# Altium schematic sheet fpga.SchDoc
size B
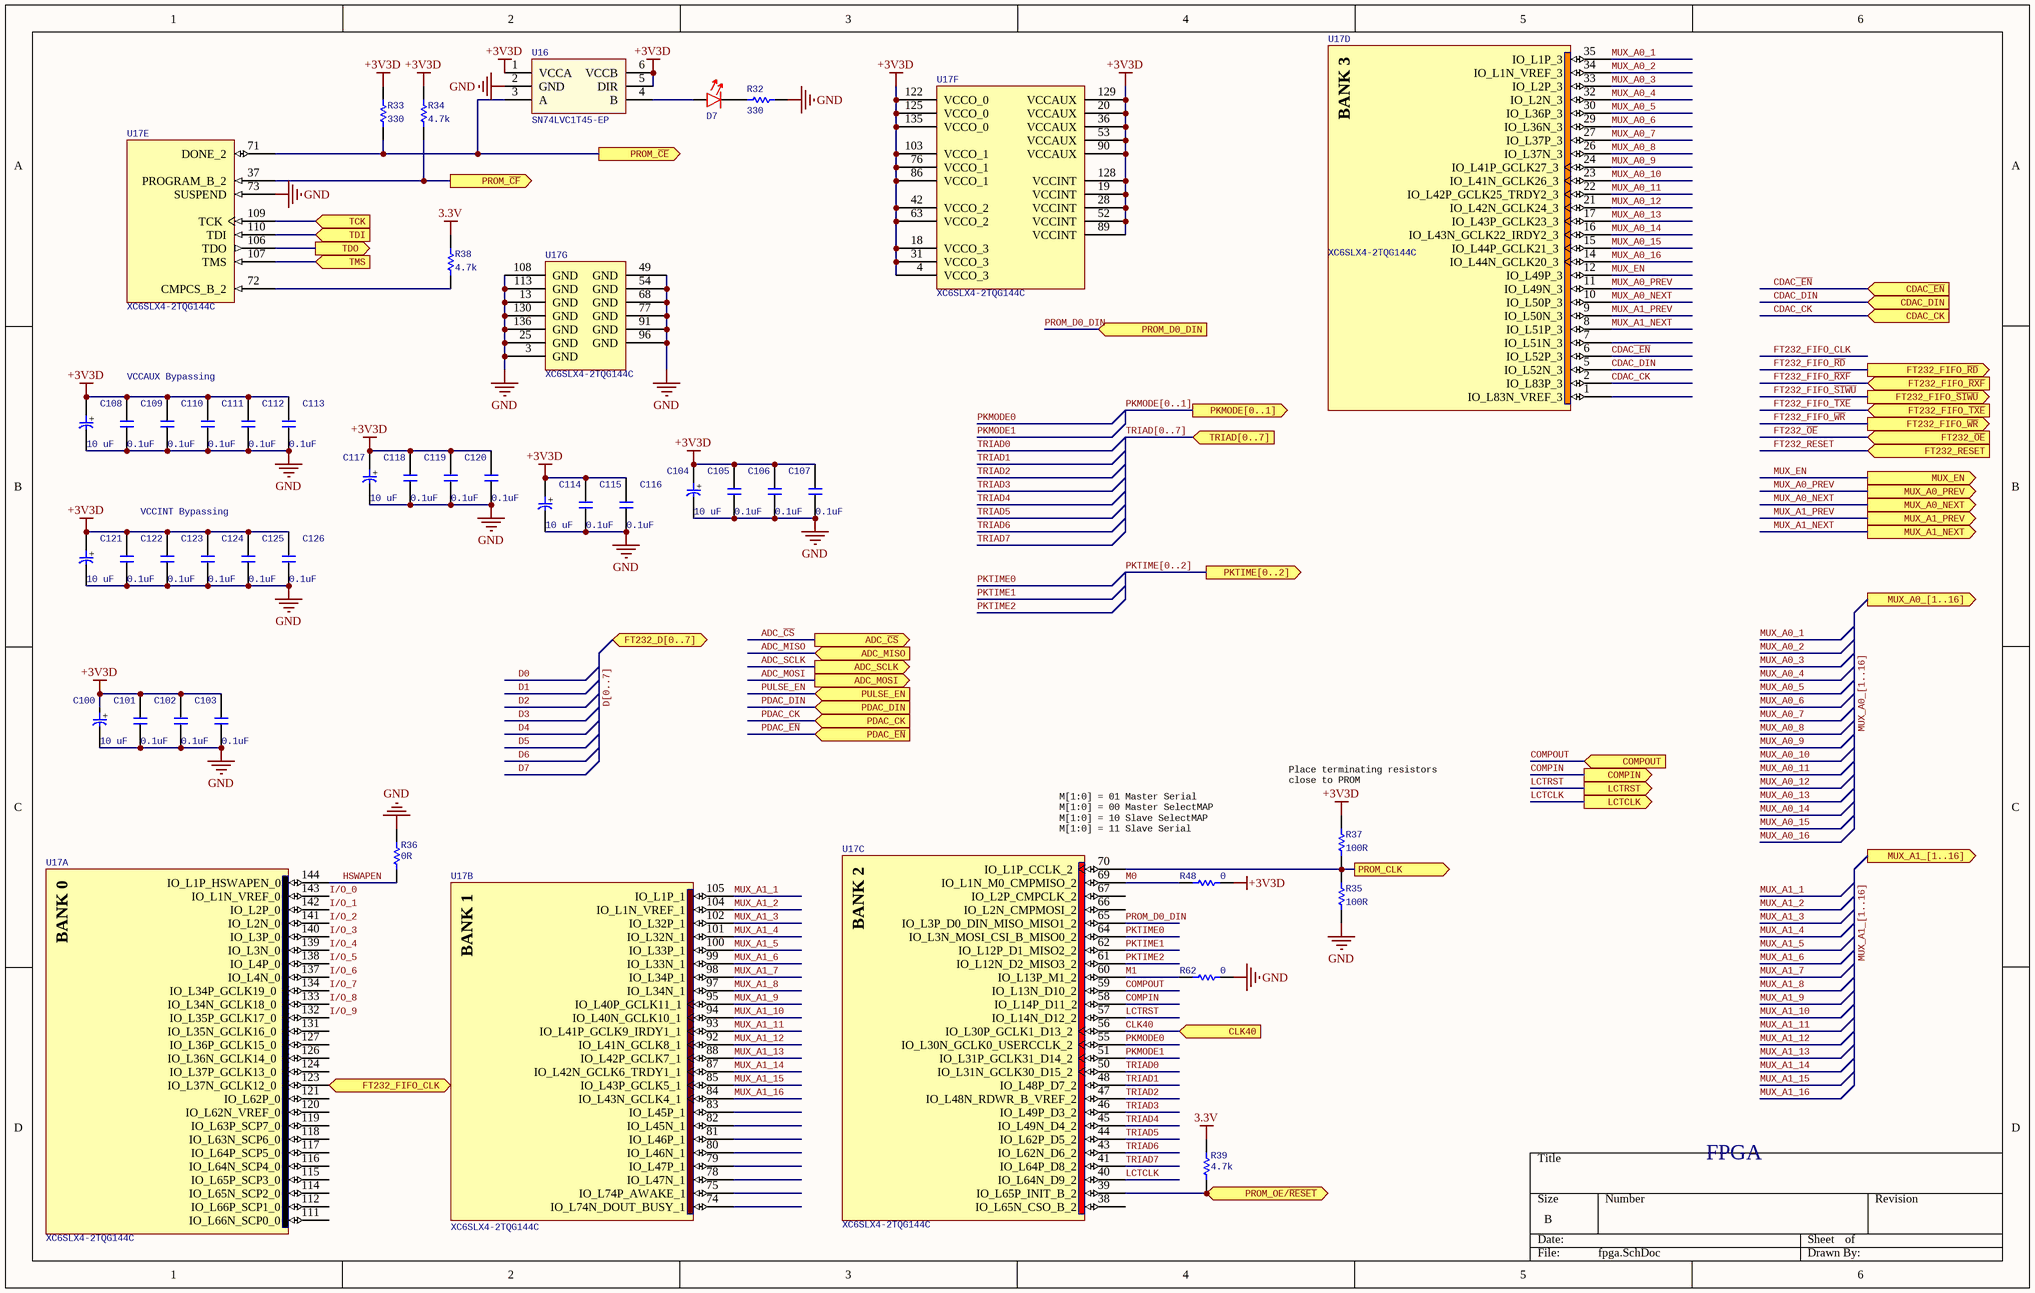
[diagram p0: fpga.SchDoc]

## Parts
C100  10 uF  [KEMET 1411]
C101  0.1uF  [0603]
C102  0.1uF  [0603]
C103  0.1uF  [0603]
C104  10 uF  [KEMET 1411]
C105  0.1uF  [0603]
C106  0.1uF  [0603]
C107  0.1uF  [0603]
C108  10 uF  [KEMET 1411]
C109  0.1uF  [0603]
C110  0.1uF  [0603]
C111  0.1uF  [0603]
C112  0.1uF  [0603]
C113  0.1uF  [0603]
C114  10 uF  [KEMET 1411]
C115  0.1uF  [0603]
C116  0.1uF  [0603]
C117  10 uF  [KEMET 1411]
C118  0.1uF  [0603]
C119  0.1uF  [0603]
C120  0.1uF  [0603]
C121  10 uF  [KEMET 1411]
C122  0.1uF  [0603]
C123  0.1uF  [0603]
C124  0.1uF  [0603]
C125  0.1uF  [0603]
C126  0.1uF  [0603]
D7  LED_RED  (value not drawn)
R32  330  [0603]
R33  330  [0603]
R34  4.7k  [0603]
R35  100R  [0603]
R36  0R  [0805]
R37  100R  [0603]
R38  4.7k  [0603]
R39  4.7k  [0603]
R48  0  [0603]
R62  0  [0603]
U16  SN74LVC1T45-EP
U17  XC6SLX4-2TQG144C  [TQG144_L]  (parts A,B,C,D,E,F,G of 7)

## Ports
ADC_MISO (in), ADC_MOSI (out), ADC_SCLK (out), ADC_~{CS} (out), CDAC_CK (in), CDAC_DIN (in), CDAC~{_EN} (in), CLK40 (in), COMPIN (out), COMPOUT (in), FT232_D[0..7] (bidir), FT232_FIFO_CLK (in), FT232_FIFO_~{RD} (out), FT232_FIFO_~{RXF} (in), FT232_FIFO_~{SIWU} (out), FT232_FIFO_~{TXE} (in), FT232_FIFO_~{WR} (out), FT232_RESET (in), FT232_~{OE} (in), LCTCLK (out), LCTRST (out), MUX_A0_[1..16] (out), MUX_A0_NEXT (out), MUX_A0_PREV (out), MUX_A1_[1..16] (out), MUX_A1_NEXT (out), MUX_A1_PREV (out), MUX_EN (out), PDAC_CK (in), PDAC_DIN (in), PDAC_~{EN} (in), PKMODE[0..1] (out), PKTIME[0..2] (out), PROM_CLK (out), PROM_D0_DIN (in), PROM_OE/~{RESET} (bidir), PROM_~{CE} (out), PROM_~{CF} (out), PULSE_EN (in), TCK (in), TDI (in), TDO (out), TMS (in), TRIAD[0..7] (in)

## Nets
3.3V: R38.2 R39.2
+3V3D: C100.1(+) C101.2 C102.2 C103.2 C104.1(+) C105.2 C106.2 C107.2 C108.1(+) C109.2 C110.2 C111.2 C112.2 C113.2 C114.1(+) C115.2 C116.2 C117.1(+) C118.2 C119.2 C120.2 C121.1(+) C122.2 C123.2 C124.2 C125.2 C126.2 R33.2 R34.2 R37.2 R48.2 U16.1(VCCA) U16.5(DIR) U16.6(VCCB) U17.4(VCCO_3) U17.18(VCCO_3) U17.19(VCCINT) U17.20(VCCAUX) U17.28(VCCINT) U17.31(VCCO_3) U17.36(VCCAUX) U17.42(VCCO_2) U17.52(VCCINT) U17.53(VCCAUX) U17.63(VCCO_2) U17.76(VCCO_1) U17.86(VCCO_1) U17.89(VCCINT) U17.90(VCCAUX) U17.103(VCCO_1) U17.122(VCCO_0) U17.125(VCCO_0) U17.128(VCCINT) U17.129(VCCAUX) U17.135(VCCO_0)
GND: C100.2(-) C101.1 C102.1 C103.1 C104.2(-) C105.1 C106.1 C107.1 C108.2(-) C109.1 C110.1 C111.1 C112.1 C113.1 C114.2(-) C115.1 C116.1 C117.2(-) C118.1 C119.1 C120.1 C121.2(-) C122.1 C123.1 C124.1 C125.1 C126.1 R32.2 R35.1 R36.1 R62.2 U16.2(GND) U17.3(GND) U17.13(GND) U17.25(GND) U17.49(GND) U17.54(GND) U17.68(GND) U17.73(SUSPEND) U17.77(GND) U17.91(GND) U17.96(GND) U17.108(GND) U17.113(GND) U17.130(GND) U17.136(GND)
ADC_~{CS}: port ADC_~{CS}
ADC_MISO: port ADC_MISO
ADC_MOSI: port ADC_MOSI
ADC_SCLK: port ADC_SCLK
CDAC~{_EN}: U17.6(IO_L52P_3) ; port CDAC~{_EN}
CDAC_CK: U17.2(IO_L83P_3) ; port CDAC_CK
CDAC_DIN: U17.5(IO_L52N_3) ; port CDAC_DIN
CLK40: U17.56(IO_L30P_GCLK1_D13_2) ; port CLK40
COMPIN: U17.58(IO_L14P_D11_2) ; port COMPIN
COMPOUT: U17.59(IO_L13N_D10_2) ; port COMPOUT
FT232_FIFO_CLK: U17.123(IO_L37N_GCLK12_0) ; port FT232_FIFO_CLK
FT232_FIFO_~{RD}: port FT232_FIFO_~{RD}
FT232_FIFO_~{RXF}: port FT232_FIFO_~{RXF}
FT232_FIFO_~{SIWU}: port FT232_FIFO_~{SIWU}
FT232_FIFO_~{TXE}: port FT232_FIFO_~{TXE}
FT232_FIFO_~{WR}: port FT232_FIFO_~{WR}
FT232_~{OE}: port FT232_~{OE}
FT232_RESET: port FT232_RESET
HSWAPEN: R36.2 U17.144(IO_L1P_HSWAPEN_0)
I/O_0: U17.143(IO_L1N_VREF_0)
I/O_1: U17.142(IO_L2P_0)
I/O_2: U17.141(IO_L2N_0)
I/O_3: U17.140(IO_L3P_0)
I/O_4: U17.139(IO_L3N_0)
I/O_5: U17.138(IO_L4P_0)
I/O_6: U17.137(IO_L4N_0)
I/O_7: U17.134(IO_L34P_GCLK19_0)
I/O_8: U17.133(IO_L34N_GCLK18_0)
I/O_9: U17.132(IO_L35P_GCLK17_0)
LCTCLK: U17.40(IO_L64N_D9_2) ; port LCTCLK
LCTRST: U17.57(IO_L14N_D12_2) ; port LCTRST
M0: R48.1 U17.69(IO_L1N_M0_CMPMISO_2)
M1: R62.1 U17.60(IO_L13P_M1_2)
MUX_A0_1: U17.35(IO_L1P_3)
MUX_A0_2: U17.34(IO_L1N_VREF_3)
MUX_A0_3: U17.33(IO_L2P_3)  [also labelled MUX_A0_[1..16]]
MUX_A0_4: U17.32(IO_L2N_3)
MUX_A0_5: U17.30(IO_L36P_3)
MUX_A0_6: U17.29(IO_L36N_3)
MUX_A0_7: U17.27(IO_L37P_3)
MUX_A0_8: U17.26(IO_L37N_3)
MUX_A0_9: U17.24(IO_L41P_GCLK27_3)
MUX_A0_10: U17.23(IO_L41N_GCLK26_3)
MUX_A0_11: U17.22(IO_L42P_GCLK25_TRDY2_3)
MUX_A0_12: U17.21(IO_L42N_GCLK24_3)
MUX_A0_13: U17.17(IO_L43P_GCLK23_3)
MUX_A0_14: U17.16(IO_L43N_GCLK22_IRDY2_3)
MUX_A0_15: U17.15(IO_L44P_GCLK21_3)
MUX_A0_16: U17.14(IO_L44N_GCLK20_3)
MUX_A0_NEXT: U17.10(IO_L50P_3) ; port MUX_A0_NEXT
MUX_A0_PREV: U17.11(IO_L49N_3) ; port MUX_A0_PREV
MUX_A1_1: U17.105(IO_L1P_1)  [also labelled MUX_A1_[1..16]]
MUX_A1_2: U17.104(IO_L1N_VREF_1)
MUX_A1_3: U17.102(IO_L32P_1)
MUX_A1_4: U17.101(IO_L32N_1)
MUX_A1_5: U17.100(IO_L33P_1)
MUX_A1_6: U17.99(IO_L33N_1)
MUX_A1_7: U17.98(IO_L34P_1)
MUX_A1_8: U17.97(IO_L34N_1)
MUX_A1_9: U17.95(IO_L40P_GCLK11_1)
MUX_A1_10: U17.94(IO_L40N_GCLK10_1)
MUX_A1_11: U17.93(IO_L41P_GCLK9_IRDY1_1)
MUX_A1_12: U17.92(IO_L41N_GCLK8_1)
MUX_A1_13: U17.88(IO_L42P_GCLK7_1)
MUX_A1_14: U17.87(IO_L42N_GCLK6_TRDY1_1)
MUX_A1_15: U17.85(IO_L43P_GCLK5_1)
MUX_A1_16: U17.84(IO_L43N_GCLK4_1)
MUX_A1_NEXT: U17.8(IO_L51P_3) ; port MUX_A1_NEXT
MUX_A1_PREV: U17.9(IO_L50N_3) ; port MUX_A1_PREV
MUX_EN: U17.12(IO_L49P_3) ; port MUX_EN
PDAC_CK: port PDAC_CK
PDAC_DIN: port PDAC_DIN
PDAC_~{EN}: port PDAC_~{EN}
PKMODE0: U17.55(IO_L30N_GCLK0_USERCCLK_2)  [also labelled PKMODE[0..1]]
PKMODE1: U17.51(IO_L31P_GCLK31_D14_2)
PKTIME0: U17.64(IO_L3N_MOSI_CSI_B_MISO0_2)  [also labelled PKTIME[0..2]]
PKTIME1: U17.62(IO_L12P_D1_MISO2_2)
PKTIME2: U17.61(IO_L12N_D2_MISO3_2)
PROM_~{CE}: R33.1 U16.3(A) U17.71(DONE_2) ; port PROM_~{CE}
PROM_~{CF}: R34.1 U17.37(PROGRAM_B_2) ; port PROM_~{CF}
PROM_CLK: R35.2 R37.1 U17.70(IO_L1P_CCLK_2) ; port PROM_CLK
PROM_D0_DIN: U17.65(IO_L3P_D0_DIN_MISO_MISO1_2) ; port PROM_D0_DIN
PROM_OE/~{RESET}: R39.1 U17.39(IO_L65P_INIT_B_2) ; port PROM_OE/~{RESET}
PULSE_EN: port PULSE_EN
TCK: U17.109(TCK) ; port TCK
TDI: U17.110(TDI) ; port TDI
TDO: U17.106(TDO) ; port TDO
TMS: U17.107(TMS) ; port TMS
TRIAD0: U17.50(IO_L31N_GCLK30_D15_2)  [also labelled TRIAD[0..7]]
TRIAD1: U17.48(IO_L48P_D7_2)
TRIAD2: U17.47(IO_L48N_RDWR_B_VREF_2)
TRIAD3: U17.46(IO_L49P_D3_2)
TRIAD4: U17.45(IO_L49N_D4_2)
TRIAD5: U17.44(IO_L62P_D5_2)
TRIAD6: U17.43(IO_L62N_D6_2)
TRIAD7: U17.41(IO_L64P_D8_2)
NetD7_1: D7.1 U16.4(B)
NetD7_2: D7.2 R32.1
NetR38_1: R38.1 U17.72(CMPCS_B_2)

Not connected (* = marked no-connect by the designer): U17 1(IO_L83N_VREF_3) 7(IO_L51N_3) 38(IO_L65N_CSO_B_2) 66(IO_L2N_CMPMOSI_2) 67(IO_L2P_CMPCLK_2) 74(IO_L74N_DOUT_BUSY_1) 75(IO_L74P_AWAKE_1) 78(IO_L47N_1) 79(IO_L47P_1) 80(IO_L46N_1) 81(IO_L46P_1) 82(IO_L45N_1) 83(IO_L45P_1) 111(IO_L66N_SCP0_0) 112(IO_L66P_SCP1_0) 114(IO_L65N_SCP2_0) 115(IO_L65P_SCP3_0) 116(IO_L64N_SCP4_0) 117(IO_L64P_SCP5_0) 118(IO_L63N_SCP6_0) 119(IO_L63P_SCP7_0) 120(IO_L62N_VREF_0) 121(IO_L62P_0) 124(IO_L37P_GCLK13_0) 126(IO_L36N_GCLK14_0) 127(IO_L36P_GCLK15_0) 131(IO_L35N_GCLK16_0)

## Notes on the sheet
- VCCAUX Bypassing
- VCCINT Bypassing
- M[1:0] = 01 Master Serial
  M[1:0] = 00 Master SelectMAP
  M[1:0] = 10 Slave SelectMAP
  M[1:0] = 11 Slave Serial
- (near R37) Place terminating resistors
  close to PROM
- FPGA
- (in symbol FPGA-XSP6-XC6SLX9-SQ144, part A) BANK 0
- (in symbol FPGA-XSP6-XC6SLX9-SQ144, part B) BANK 1
- (in symbol FPGA-XSP6-XC6SLX9-SQ144, part C) BANK 2
- (in symbol FPGA-XSP6-XC6SLX9-SQ144, part D) BANK 3

## Library data of the parts
C100 C104 C108 C114 C117 C121 = C10uF Electro.
C101-C103 C105-C107 C109-C113 C115 C116 C118-C120 C122-C126 = C0.1uF
D7 = LED_RED: Manufacturer: Lite-On Inc; Manufacturer Part Number: LTST-C191KRKT; Color: Red; Wavelength - Dominant: 631nm; Wavelength - Peak: 639nm; Millicandela Rating: 54mcd; Voltage - Forward (Vf) (Typ): 2V; Current - Test: 20mA; Viewing Angle: 130°; Lens Type: Clear; Lens Style/Size: Rectangle with Flat Top, 1.1mm x 0.8mm; RoHS: RoHS Compliant; Category: Optoelectronics; Packaging: Cut Tape (CT); Package / Case: 0603 (1608 Metric); Size / Dimension: 1.60mm L x 0.80mm W; Height: 0.55mm; Mounting Type: Surface Mount; Luminous Flux @ Current - Test: -; ComponentLink1URL: http://optoelectronics.liteon.com/upload/download/DS22-2000-223/S_110_LTST-C191KRKT.pdf; ComponentLink1Description: http://optoelectronics.liteon.com/upload/download/DS22-2000-223/S_110_LTST-C191KRKT.pdf
R32 R33 = R330
R34 R38 R39 = R4K7
R35 R37 = R100
R36 = R0: R330
R48 R62 = R0
U16 = SN74LVC1T45-EP: SINGLE-BIT DUAL-SUPPLY BUS TRANSCEIVER
U17 = FPGA-XSP6-XC6SLX9-SQ144: Spartan-6 LX 1.2V FPGA, 102 User I/Os, 144-Pin TQFP (0.5mm Pitch), Speed Grade 2, Commercial Grade, Pb-Free; PackageReference: TQG144; Code_JEDEC: MS-026-BFB; DatasheetVersion: ver1.6, Nov-2010; PackageVersion: ver1.2, Jun-2004; PackageDescription: 144-Pin Thin Quad Flat Pack (TQG144) - Pb-Free